# Altium schematic sheet Schematic.SchDoc: Primary Side Hardware
size A4; Author: Suzanne Lo; Revision: A; SheetNumber: 1; SheetTotal: 1
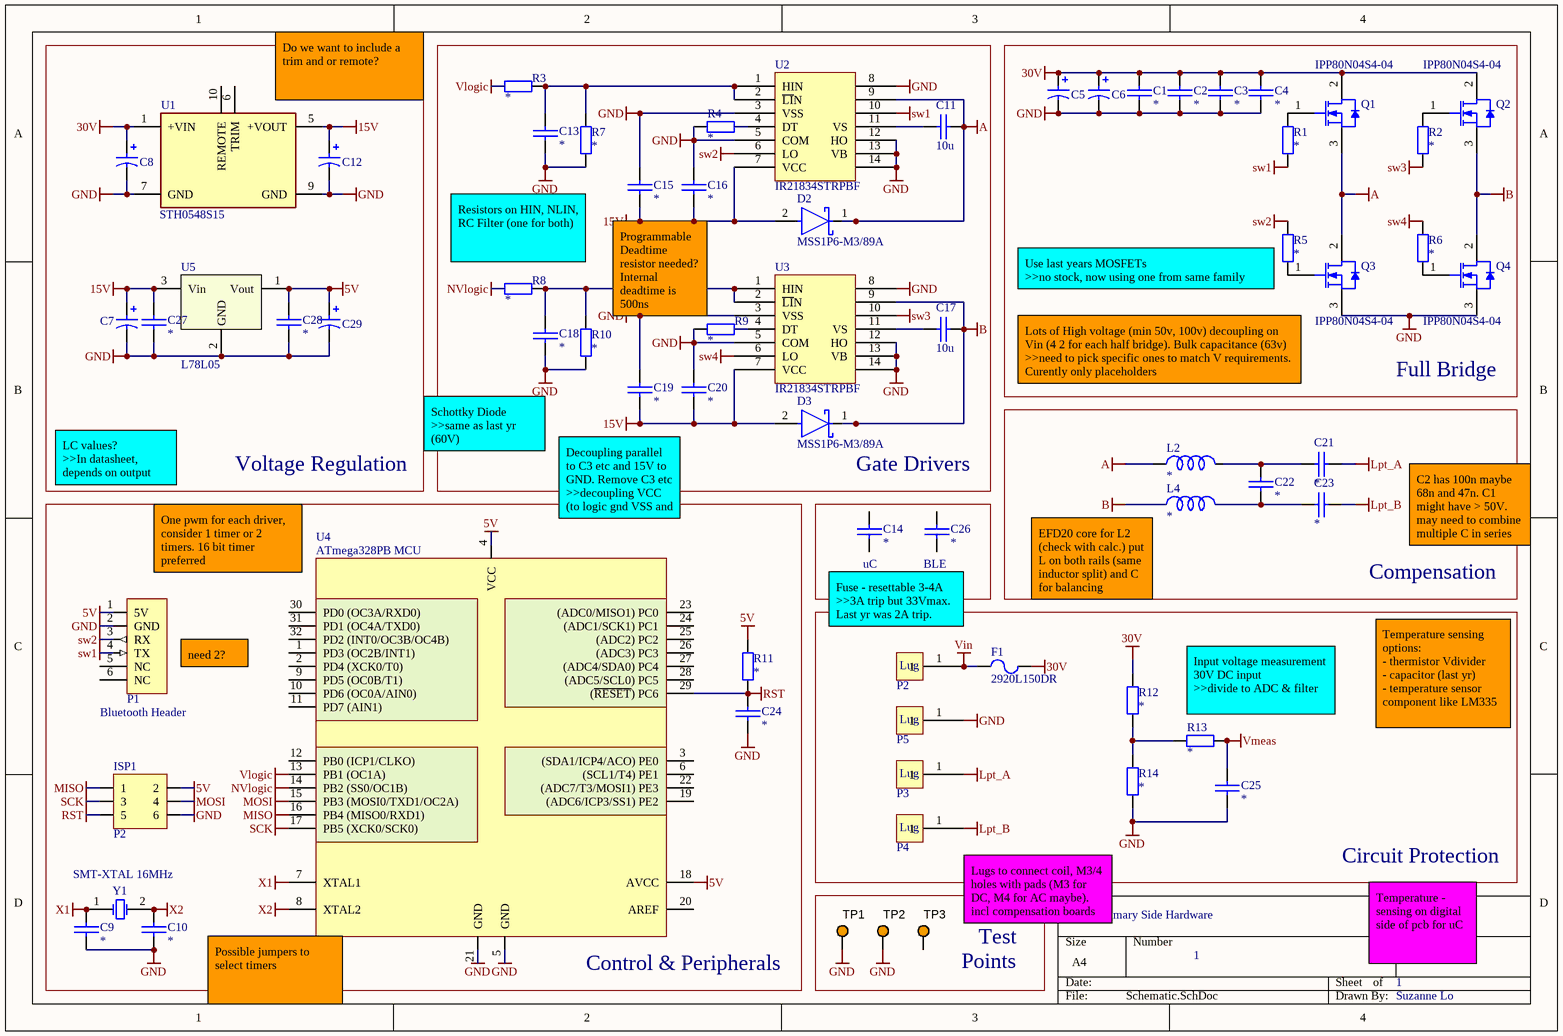
[diagram p0: Schematic.SchDoc]

## Parts
C1  *  [0805 CAP]
C2  *  [0805 CAP]
C3  *  [0805 CAP]
C4  *  [0805 CAP]
C5  *  [CAP POL 8x5.4mm SMT]  (value not drawn)
C6  *  [CAP POL 8x5.4mm SMT]  (value not drawn)
C7  *  [CAP POL 8x5.4mm SMT]  (value not drawn)
C8  10u  [CAP POL 8x5.4mm SMT]  (value not drawn)
C9  *  [0805 CAP]
C10  *  [0805 CAP]
C11  10u  [0805 CAP]
C12  10u  [CAP POL 8x5.4mm SMT]  (value not drawn)
C13  *  [0805 CAP]
C14  *  [0805 CAP]
C15  *  [0805 CAP]
C16  *  [0805 CAP]
C17  10u  [0805 CAP]
C18  *  [0805 CAP]
C19  *  [0805 CAP]
C20  *  [0805 CAP]
C21  *  [0805 CAP]
C22  *  [0805 CAP]
C23  *  [0805 CAP]
C24  *  [0805 CAP]
C25  *  [0805 CAP]
C26  *  [0805 CAP]
C27  *  [0805 CAP]
C28  *  [0805 CAP]
C29  *  [CAP POL 8x5.4mm SMT]  (value not drawn)
D2  MSS1P6-M3/89A  [FP-96591-MFG]
D3  MSS1P6-M3/89A  [FP-96591-MFG]
F1  2920L150DR  [LFUS-2920L150DR_V]
ISP1  P2  [HDR2X3]
L2  *
L4  *
P1  BLE Module Header  [HM10_HDR1X6]  (value not drawn)
P2  Lug  [M3 Lug]
P3  Lug  [M3 Lug]
P4  Lug  [M3 Lug]
P5  Lug  [M3 Lug]
Q1  IPP80N04S4-04  [INF-PG-TO220-3-1]
Q2  IPP80N04S4-04  [INF-PG-TO220-3-1]
Q3  IPP80N04S4-04  [INF-PG-TO220-3-1]
Q4  IPP80N04S4-04  [INF-PG-TO220-3-1]
R1  *  [0805 RES]
R2  *  [0805 RES]
R3  *  [0805 RES]
R4  *  [0805 RES]
R5  *  [0805 RES]
R6  *  [0805 RES]
R7  *  [0805 RES]
R8  *  [0805 RES]
R9  *  [0805 RES]
R10  *  [0805 RES]
R11  *  [0805 RES]
R12  *  [0805 RES]
R13  *  [0805 RES]
R14  *  [0805 RES]
TP1  5003  [TP_TH]  (value not drawn)
TP2  5003  [TP_TH]  (value not drawn)
TP3  5003  [TP_TH]  (value not drawn)
U1  STH0548S15  [STH0548S15]
U2  IR21834STRPBF  [SOIC127P600X175-14N]
U3  IR21834STRPBF  [SOIC127P600X175-14N]
U4  ATmega328PB MCU  [32 - TQFP]
U5  L78L05  [SOT-89]
Y1  SMT-XTAL 16MHz  [HC49-US]

## Blocks framed on the sheet
Voltage Regulation: C7 C8 C12 C27-C29 U1 U5
Gate Drivers: C11 C13 C15-C20 D2 D3 R3 R4 R7-R10 U2 U3
Full Bridge: C1-C6 Q1-Q4 R1 R2 R5 R6
Compensation: C21-C23 L2 L4
Control & Peripherals: C9 C10 C24 ISP1 P1 R11 U4 Y1

## Nets
5V: C28.2 C29.1 ISP1.2 P1.1(5V) R11.2 U4.4(VCC) U4.18(AVCC) U5.1(Vout)
15V: C7.1 C12.1 C15.1 C16.1 C19.1 C20.1 C27.2 D2.2(A) D3.2(A) U1.5(+VOUT) U2.7(VCC) U3.7(VCC) U5.3(Vin)
30V: C1.1 C2.1 C3.1 C4.2 C5.1 C6.1 C8.1 F1.2 Q1.2(DRAIN) Q2.2(DRAIN) R12.2 U1.1(+VIN)
A: C11.1 D2.1(C) Q1.3(SOURCE) Q3.2(DRAIN) U2.9
B: C17.1 D3.1(C) L4.?1 Q2.3(SOURCE) Q4.2(DRAIN) U3.9
GND: C1.2 C2.2 C3.2 C4.1 C5.2 C6.2 C7.2 C8.2 C9.1 C10.1 C12.2 C13.1 C15.2 C16.2 C18.1 C19.2 C20.2 C24.1 C25.1 C27.1 C28.1 C29.2 ISP1.6 P1.2(GND) P5.1 Q3.3(SOURCE) Q4.3(SOURCE) R4.2 R7.1 R9.1 R10.1 R14.1 TP1.1 TP2.1 U1.7(GND) U1.9(GND) U2.3(VSS) U2.5(COM) U2.8 U2.12(HO) U2.13(VB) U2.14 U3.3(VSS) U3.5(COM) U3.8 U3.12(HO) U3.13(VB) U3.14 U4.5(GND) U4.21(GND) U5.2(GND)
Lpt_A: C21.2 P3.1
Lpt_B: C23.2 P4.1
MISO: ISP1.1 U4.16(PB4_(MISO0/RXD1))
MOSI: ISP1.4 U4.15(PB3_(MOSI0/TXD1/OC2A))
NVlogic: R8.1 U4.14(PB2_(SS0/OC1B))
RST: C24.2 ISP1.5 R11.1 U4.29((~{RESET})_PC6)
SCK: ISP1.3 U4.17(PB5_(XCK0/SCK0))
sw1: P1.4(TX) R1.1 U2.10
sw2: P1.3(RX) R5.2 U2.6(LO)
sw3: R2.1 U3.10
sw4: R6.2 U3.6(LO)
Vin: F1.1 P2.1
Vlogic: R3.1 U4.13(PB1_(OC1A))
Vmeas: C25.2 R13.1
X1: C9.2 U4.7(XTAL1) Y1.1(OSC1)
X2: C10.2 U4.8(XTAL2) Y1.2(OSC2)
NetC11_2: C11.2 U2.11(VS)
NetC13_2: C13.2 R3.2 R7.2 U2.1(HIN) U2.2(~{LI}N)
NetC17_2: C17.2 U3.11(VS)
NetC18_2: C18.2 R8.2 R10.2 U3.1(HIN) U3.2(~{LI}N)
NetC21_1: C21.1 C22.2
NetC22_1: C22.1 C23.1 L4.?2
NetQ1_1: Q1.1(GATE) R1.2
NetQ2_1: Q2.1(GATE) R2.2
NetQ3_1: Q3.1(GATE) R5.1
NetQ4_1: Q4.1(GATE) R6.1
NetR4_1: R4.1 U2.4(DT)
NetR9_2: R9.2 U3.4(DT)
NetR12_1: R12.1 R13.2 R14.2

Not connected (* = marked no-connect by the designer): C14 1 2; C26 1 2; L2 ?1 ?2; P1 5(NC) 6(NC); TP3 1; U1 6(TRIM) 10(REMOTE); U4 1(PD3_(OC2B/INT1)) 2(PD4_(XCK0/T0)) 3((SDA1/ICP4/ACO)_PE0) 6((SCL1/T4)_PE1) 9(PD5_(OC0B/T1)) 10(PD6_(OC0A/AIN0)) 11(PD7_(AIN1)) 12(PB0_(ICP1/CLKO)) 19((ADC6/ICP3/SS1)_PE2) 20(AREF) 22((ADC7/T3/MOSI1)_PE3) 23((ADC0/MISO1)_PC0) 24((ADC1/SCK1)_PC1) 25((ADC2)_PC2) 26((ADC3)_PC3) 27((ADC4/SDA0)_PC4) 28((ADC5/SCL0)_PC5) 30(PD0_(OC3A/RXD0)) 31(PD1_(OC4A/TXD0)) 32(PD2_(INT0/OC3B/OC4B))

## Notes on the sheet
- (near U1) Do we want to include a trim and or remote?
- Resistors on HIN, NLIN, RC Filter (one for both)
- (near R9) Programmable Deadtime resistor needed? Internal deadtime is 500ns
- (near R5) Use last years MOSFETs
  >>no stock, now using one from same family
- (near Q3) Lots of High voltage (min 50v, 100v) decoupling on Vin (4 2 for each half bridge). Bulk capacitance (63v)
  >>need to pick specific ones to match V requirements. Curently only placeholders
- Schottky Diode
  >>same as last yr (60V)
- LC values?
  >>In datasheet, depends on output
- Decoupling parallel to C3 etc and 15V to GND. Remove C3 etc
  >>decoupling VCC (to logic gnd VSS and COM) and VS (high side supply)
- (near U4) One pwm for each driver, consider 1 timer or 2 timers. 16 bit timer preferred
- (near C14) uC
- (near C26) BLE
- C2 has 100n maybe 68n and 47n. C1 might have > 50V. may need to combine multiple C in series
- Digital Decoupling
- Fuse - resettable 3-4A
  >>3A trip but 33Vmax. Last yr was 2A trip. 60Vmax
- (near L4) EFD20 core for L2 (check with calc.) put L on both rails (same inductor split) and C for balancing
- (near P1) Bluetooth Header
- need 2?
- (near R13) Input voltage measurement 30V DC input
  >>divide to ADC & filter
- Temperature sensing options:
  - thermistor Vdivider
  - capacitor (last yr)
  - temperature sensor component like LM335
- (near P4) Text
- Lugs to connect coil, M3/4 holes with pads (M3 for DC, M4 for AC maybe). incl compensation boards
- Circuit Protection
- (near TP3) Test Points
- Temperature - sensing on digital side of pcb for uC
- (near U4) Possible jumpers to select timers

## Library data of the parts
C1-C4 C9-C11 C13-C28 = CerCap_SMT_0805: SMT ceramic capacitor 0805 size
  C1-C4 C9 C10 C13-C16 C18-C28: Value: *
  C11 C17: Value: 10u
C5-C8 C12 C29 = ElecCap_SMT_8D0: CAP ALUM 22UF 20% 50V SMD (Model: UWX1H220MCL1GB); Manufacturer: Nichicon; Manufacturer Part Number: UWX1V220MCL1GB; Lifetime @ Temp.: 2000 Hrs @ 85°C; Polarization: Polar; Surface Mount Land Size: 0.260" L x 0.260" W (6.60mm x 6.60mm); Capacitance 1: 22 µF; Revision: July-2002: Re-released for DXP Platform.; RoHS: RoHS Compliant; Category: Capacitors; Stock 1: 680; Pricing 1: 1=0.59, 10=0.406, 100=0.2304, 500=0.16268 (NZD); Packaging: Cut Tape (CT); Part Status: Active; Tolerance: ±20%; ESR (Equivalent Series Resistance): -; Operating Temperature: -40°C ~ 85°C; Ratings: -; Applications: General Purpose; Lead Spacing: -; Size / Dimension: 0.248" Dia (6.30mm); Height - Seated (Max): 0.213" (5.40mm); Mounting Type: Surface Mount; Package / Case: Radial, Can - SMD; ComponentLink1URL: http://nichicon-us.com/english/products/pdfs/e-uwx.pdf; ComponentLink1Description: http://nichicon-us.com/english/products/pdfs/e-uwx.pdf; Supplier 1: Digi-Key; Supplier Part Number 1: 493-2136-1-ND
  C5-C7 C29: Value: *
  C8 C12: Value: 10u
D2 D3 = MSS1P6-M3/89A: DIODE SCHOTTKY 60V 1A MICROSMP; Manufacturer: Vishay; Max Junction Temp: +150°C; Peak Reverse Current: 20uA; Max Surge Forward Current: 25A; Capacitance: 40pF; Value: 40pF; Temperature Range Low: -55°C; Automotive: No; Manufacturer Part Number: MSS1P6-M3/89A; ComponentLink2Description: Datasheet; RoHS: TRUE; Temperature Range High: +150°C; Forward Current: 1A; Height: 0.73mm; Max Repetitive Reverse Voltage: 60V; Device Class L2: Diodes; Octopart: https://octopart.com/mss1p6-m3%2F89a-vishay-42763284; Digikey Description: DIODE SCHOTTKY 60V 1A MICROSMP; Device Class L1: Discrete Semiconductors; Package: 96591; ComponentLink2URL: http://www.vishay.com/docs/89018/mss1p6.pdf; Category: Diode; Temperature: -55°C to +150°C; Footprint Url: http://www.vishay.com/docs/96591/microsmp_do-219ad_fredpt.pdf; Mouser Description: Schottky Diodes & Rectifiers 1.0 Amp 60 Volt; Device Class L3: Schottky Diodes; Lead Free: Yes
F1 = 2920L150DR: PTC Resettable Fuse 1.5A(hold) 3A(trip) 33VDC 40A 1.5W 2s 0.08Ohm SMD Solder Pad 2920 T/R; Manufacturer: Littelfuse; Operating Supply Voltage: 33V; Resistance: 230mR; Approvals: cULus,TUV; Supplier 1: Digi-Key; Manufacturer Part Number: 2920L150DR; RoHS: Yes; Category: PTC Resettable Fuses; Stock 1: 8939; Pricing 1: 1=0.66000, 5=0.64400, 10=0.62400, 50=0.52520, 100=0.43600, 250=0.39640, 500=0.33694 (USD); Case/Package: 2920; Case Code (Metric): 7351; Case Code (Imperial): 2920; Terminal Material: Copper; Min Operating Temperature: -40°C; Max Operating Temperature: 85°C; Package Quantity: 1500; Packaging: Tape and Reel; Max Current Rating: 40A; Voltage Rating: 33V; Current Rating: 40A; Termination: SMD/SMT; Power Dissipation: 1.5W; Working Voltage: 33V; Voltage Rating (DC): 33V; Hold Current: 1.5A; Trip Current: 3A; Time to Trip: 2s; Series: 2920L; Length: 7.98mm; Width: 5.44mm; Height: 1.25mm; REACH SVHC: No SVHC; Lead Free: Lead Free; RoHS Compliant: Yes; ComponentLink1URL: https://datasheet.ciiva.com/30470/0900766b8128f916-30470046.pdf?src-supplier=RSComponents; ComponentLink1Description: https://datasheet.ciiva.com/30470/0900766b8128f916-30470046.pdf?src-supplier=RSComponents; ComponentLink2URL: https://datasheet.ciiva.com/14119/2920l-eng-datasheet-14119786.pdf?src-supplier=Distrelec; ComponentLink2Description: https://datasheet.ciiva.com/14119/2920l-eng-datasheet-14119786.pdf?src-supplier=Distrelec; ComponentLink3URL: https://datasheet.ciiva.com/325/littelfuse-ptc-2920l-325940.pdf?src-supplier=Digi-Key; ComponentLink3Description: https://datasheet.ciiva.com/325/littelfuse-ptc-2920l-325940.pdf?src-supplier=Digi-Key; ComponentLink4URL: https://datasheet.ciiva.com/325/littelfuse-ptc-2920l-325941.pdf?src-supplier=Digi-Key; ComponentLink4Description: https://datasheet.ciiva.com/325/littelfuse-ptc-2920l-325941.pdf?src-supplier=Digi-Key; ComponentLink5URL: https://datasheet.ciiva.com/325/littelfuse-ptc-2920l-325942.pdf?src-supplier=Digi-Key; ComponentLink5Description: https://datasheet.ciiva.com/325/littelfuse-ptc-2920l-325942.pdf?src-supplier=Digi-Key; ComponentLink6URL: https://datasheet.ciiva.com/1273/578244-1273819.pdf?src-supplier=Element14; ComponentLink6Description: https://datasheet.ciiva.com/1273/578244-1273819.pdf?src-supplier=Element14; ComponentLink7URL: https://datasheet.ciiva.com/16305/littelfuse-ptc-2920l-16305114.pdf?src-supplier=Future+Electronics; ComponentLink7Description: https://datasheet.ciiva.com/16305/littelfuse-ptc-2920l-16305114.pdf?src-supplier=Future+Electronics; ComponentLink8URL: https://datasheet.ciiva.com/15226/getdatasheetpartid-158319-15226903.pdf?src-supplier=Verical; ComponentLink8Description: https://datasheet.ciiva.com/15226/getdatasheetpartid-158319-15226903.pdf?src-supplier=Verical; ComponentLink9URL: https://datasheet.ciiva.com/28410/699682-28410950.pdf?src-supplier=Element14; ComponentLink9Description: https://datasheet.ciiva.com/28410/699682-28410950.pdf?src-supplier=Element14
ISP1 = Header 3X2: Header, 3-Pin, Dual row; LatestRevisionDate: 17-Jul-2002; LatestRevisionNote: Re-released for DXP Platform.; Publisher: Altium Limited
L2 L4 = L: Value: *
P1 = BLEModule_TH: 2.54mm pitch 6-pin header for BLE module; LatestRevisionDate: 17-Jul-2002; LatestRevisionNote: Re-released for DXP Platform.; Publisher: Altium Limited
Q1-Q4 = CMP-1138-00045-1: OptiMOS-T2 Power-Transistor, 40 V VDS, 80 A ID, PG-TO220-3-1, Tube, Green; Manufacturer: Infineon; VDS (max): 40 V; RDS (on) (max) (@10V): 4.6 mOhm; Ptot (max): 71 W; IDpuls (max): 320 A; Green: TRUE; VGS(th) (max): 4 V; QG: 33 nC; RthJC (max): 2.1 K/W; ID (max): 80 A; VGS(th) (min): 2 V; PartNumber: IPP80N04S4-04; ComponentLink2Description: Datasheet; DatasheetVersion: Rev. 1.0; Halogen-free: TRUE; ComponentLink3Description: Package Specification; PackageDescription: 3-Pin Plastic (Green) Transistor Single Outline Package, 10 x 9.25 mm Body, 2.54 mm Pitch; ComponentLink3URL: http://www.infineon.com/dgdl/BTS117_DS_14.pdf?folderId=db3a30431400ef68011421b54e2e0564&fileId=db3a30433a747525013abff8302d549c&location=en.Products.Automotive_ICs.Smart_High-_and_Low-Side_Switches.HITFET___TEMPFET__-_Smart_Low-Side_Switches.DATASHEET.BTS1; PackageReference: PG-TO220-3-1; PackageVersion: Jul-12; Packing: Tube; ComponentLink1Description: Manufacturer URL; ComponentLink2URL: http://www.infineon.com/dgdl/IPP_B_I80N04S4-04_DS_1_0.pdf?folderId=db3a304412b407950112b42b75b74520&fileId=db3a304328c6bd5c01291c71d4085dfa&location=en.Products.Automotive_ICs.Automotive_MOSFETs.Single__N-Channel_40V_MOSFETs.DATASHEET.IPP_B_I80N04S4-04_DS_; Mounting Technology: Through Hole; ComponentLink1URL: http://www.infineon.com/; Technology: OptiMOS-T2
R1-R14 = Res_SMT_0805: 0805 resistor; Published: 8-Jun-2000; LatestRevisionDate: 17-Jul-2002; LatestRevisionNote: Re-released for DXP Platform.; PackageReference: AXIAL-0.4; Publisher: Altium Limited; Value: *; ComponentLink1Description: https://nz.mouser.com/datasheet/2/315/AOA0000C304-1149620.pdf
TP1-TP3 = TestPoint: Test Point, Orange, 1-Pin THD, RoHS; Peak Reverse Current: 600 uA; Forward Current: 3 A; Max Surge Current: 80 A; Forward Voltage: 1.08 V; Max Operating Temperature: 150 degC; PackageReference: 5003; Pins: 2; ComponentLink2URL: http://keyelco.com/userAssets/file/M65p56.pdf; PackageDescription: 1-Pin Through Hole Device, Dia 2.54 mm; Weight: 0.01 lb; Diameter: 5.3 mm; Mount: Through Hole; Package Quantity: 500; Packaging: Bulk; Min Operating Temperature: -65 degC; ComponentLink1Description: Manufacturer URL; Height: 0.25 inch; ComponentLink1URL: http://www.keyelco.com/; ComponentLink2Description: Datasheet; Width: 0.25 inch; REACH SVHC: No SVHC; RoHSCompliant: true; Radiation Hardening: No; Length: 9.5 mm; DatasheetVersion: Jun-15
U1 = STH0548S15: Power Supply; Manufacturer_Name: XP POWER; Datasheet Link: https://4donline.ihs.com/images/VipMasterIC/IC/XPPO/XPPO-S-A0009456324/XPPO-S-A0009456324-1.pdf?hkey=EF798316E3902B6ED9A73243A3159BB0; Height: 5.5mm; Manufacturer_Part_Number: STH0548S15
U2 U3 = IR21834STRPBF: 600 V half-bridge gate driver IC with programmable deadtime, SOIC 14N, RoHS; Manufacturer: International Rectifier; Number of Outputs: 2; Max Supply Voltage: 20V; Min Supply Voltage: 10V; Max Power Dissipation: 1W; Turn-On Delay Time: 35ns; Max Supply Current: 1.6mA; Rise Time: 60ns; Output Current: 1.9A; Nominal Supply Current: 1mA; Propagation Delay: 330ns; Max Output Current: 2.3A; Supplier 1: Newark; Manufacturer Part Number: IR21834STRPBF; RoHS: Yes; Category: Gate Drivers; Mount: Surface Mount; Case/Package: SOIC; Number of Pins: 14; Min Operating Temperature: -40°C; Max Operating Temperature: 125°C; Packaging: Tape and Reel; Package Quantity: 1; Series: -; Output Voltage: 20V; Number of Drivers: 2; Fall Time: 35ns; Turn-Off Delay Time: 35ns; Power Dissipation: 1W; Length: 8.74mm; Width: 3.99mm; Height: 1.5mm; REACH SVHC: No SVHC; RoHS Compliant: Yes; ComponentLink1URL: https://datasheet.ciiva.com/26878/ir21834strpbf-26878870.pdf?src-supplier=IIIC; ComponentLink1Description: https://datasheet.ciiva.com/26878/ir21834strpbf-26878870.pdf?src-supplier=IIIC; ComponentLink2URL: https://datasheet.ciiva.com/8068/ir2183-8068250.pdf?src-supplier=Element14; ComponentLink2Description: https://datasheet.ciiva.com/8068/ir2183-8068250.pdf?src-supplier=Element14; ComponentLink3URL: https://datasheet.ciiva.com/1950/ir2183-1950222.pdf?src-supplier=Digi-Key; ComponentLink3Description: https://datasheet.ciiva.com/1950/ir2183-1950222.pdf?src-supplier=Digi-Key; ComponentLink4URL: https://datasheet.ciiva.com/1950/ir2183-1950223.pdf?src-supplier=Digi-Key; ComponentLink4Description: https://datasheet.ciiva.com/1950/ir2183-1950223.pdf?src-supplier=Digi-Key; ComponentLink5URL: https://datasheet.ciiva.com/1950/ir2183-1950221.pdf?src-supplier=Digi-Key; ComponentLink5Description: https://datasheet.ciiva.com/1950/ir2183-1950221.pdf?src-supplier=Digi-Key; ComponentLink6URL: https://datasheet.ciiva.com/16287/ir2183-16287545.pdf?src-supplier=Future+Electronics; ComponentLink6Description: https://datasheet.ciiva.com/16287/ir2183-16287545.pdf?src-supplier=Future+Electronics
U4 = ATmega328PB_SMT_TQFP32: IC MCU 8BIT 32KB FLASH 32TQFP; Manufacturer: Atmel; Manufacturer Part Number: ATMEGA328PB-AN; Core Processor: AVR; Core Size: 8-Bit; Speed: 20MHz; Connectivity: I²C, SPI, UART/USART; Peripherals: Brown-out Detect/Reset, POR, PWM, WDT; Number of I/O: 27; Program Memory Size: 32KB (16K x 16); EEPROM Size: 1K x 8; RAM Size: 2K x 8; Voltage - Supply (Vcc/Vdd): 1.8 V ~ 5.5 V; Data Converters: A/D 8x10b; Oscillator Type: Internal; Supplier 1: Digi-Key; RoHS: RoHS Compliant; Category: Integrated Circuits (ICs); Stock 1: 366; Pricing 1: 1=2.74, 10=2.448, 25=2.2032, 100=2.0074, 250=1.81152, 500=1.62548, 1000=1.37088 (USD); Packaging: Tray; Part Status: Active; Program Memory Type: FLASH; Operating Temperature: -40°C ~ 105°C (TA); Package / Case: 32-TQFP; Supplier Device Package: 32-TQFP (7x7); ComponentLink1URL: http://www.atmel.com/images/atmel-42397-8-bit-avr-microcontroller-atmega328pb_datasheet.pdf; ComponentLink1Description: http://www.atmel.com/images/atmel-42397-8-bit-avr-microcontroller-atmega328pb_datasheet.pdf
U5 = L78L05_SMT_SOT89: LDO Voltage Regulator 5V; ComponentLink1URL: http://www.st.com/content/ccc/resource/technical/document/datasheet/99/3b/7d/91/91/51/4b/be/CD00000544.pdf/files/CD00000544.pdf/jcr:content/translations/en.CD00000544.pdf; ComponentLink1Description: http://www.st.com/content/ccc/resource/technical/document/datasheet/99/3b/7d/91/91/51/4b/be/CD00000544.pdf/files/CD00000544.pdf/jcr:content/translations/en.CD00000544.pdf; Supplier 1: Digi-Key; Supplier Part Number 1: 497-1181-1-ND
Y1 = TXC9C-16_XTAL_SMT: 9C-16.000MAAJ-T crystal 16.0000MHZ 18PF SMD; Manufacturer: TXC CORPORATION; Frequency Stability: ±30ppm; Operating Mode: Fundamental; Supplier 1: Digi-Key; Manufacturer Part Number: 9C-16.000MAAJ-T; RoHS: RoHS Compliant; Category: Crystals, Oscillators, Resonators; Stock 1: 11514; Pricing 1: 1=0.75, 10=0.628, 50=0.5656, 100=0.5026, 500=0.47744 (NZD); Packaging: Cut Tape (CT); Part Status: Active; Type: MHz Crystal; Frequency Tolerance: ±30ppm; Load Capacitance: 18pF; Operating Temperature: -20°C ~ 70°C; Ratings: -; Mounting Type: Surface Mount; Package / Case: HC-49/US; Size / Dimension: 0.449" L x 0.189" W (11.40mm x 4.80mm); Height - Seated (Max): 0.161" (4.10mm); ComponentLink1URL: http://www.txccorp.com/download/products/quartz_crystals/2015TXC_9C_32.pdf; ComponentLink1Description: http://www.txccorp.com/download/products/quartz_crystals/2015TXC_9C_32.pdf; Supplier Part Number 1: 887-1059-1-ND